# EAGLE design trackuino sensor mk2 chip (EAGLE 7.1.0)
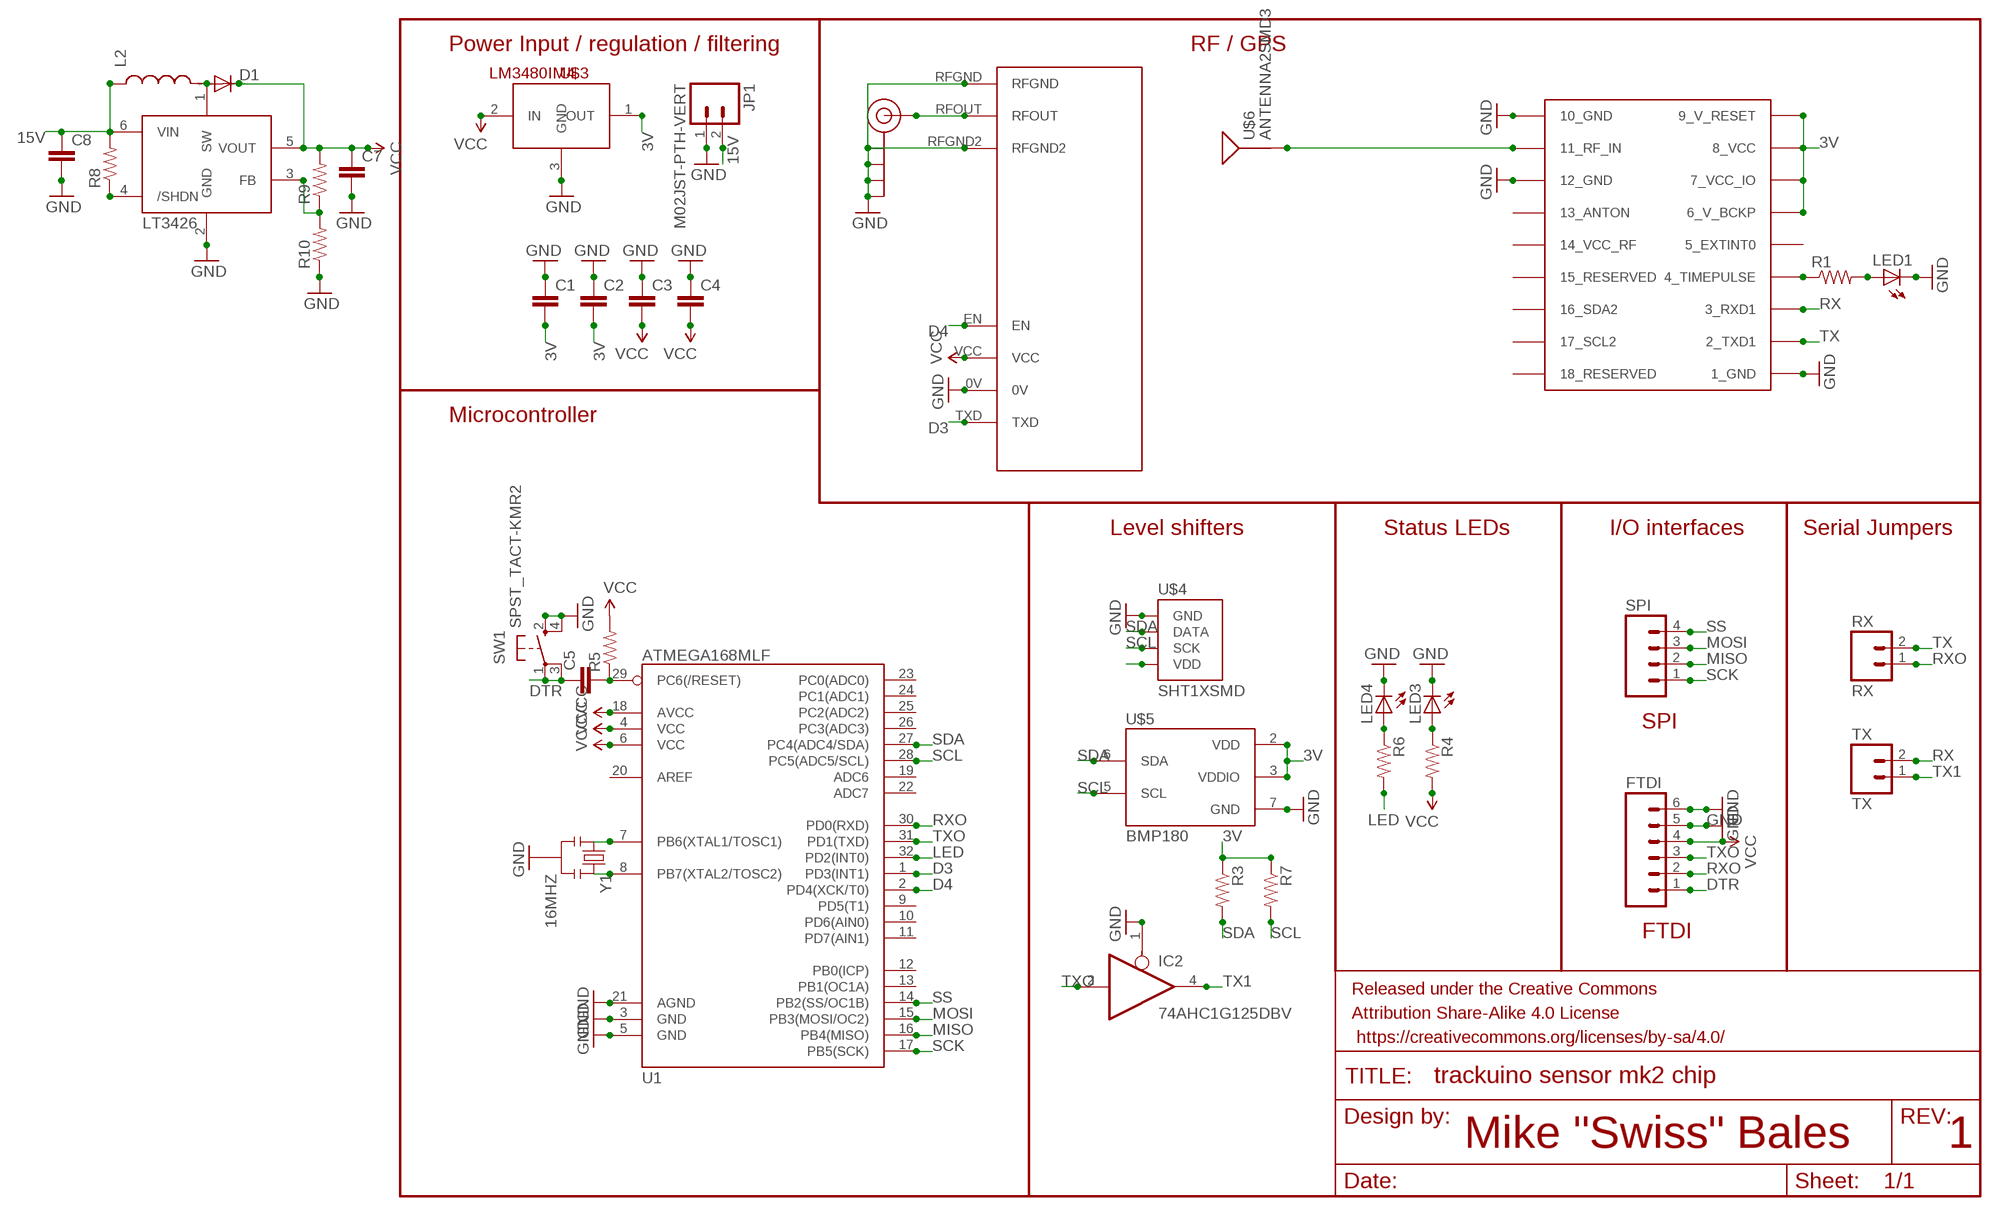
[diagram p0: schematic, sheet 1]

## Parts
C1  CAP0805  [0805]
C2  CAP0805  [0805]
C3  CAP0805  [0805]
C4  CAP0805  [0805]
C5  CAP0805  [0805]
C7  CAP0805  [0805]
C8  CAP0805  [0805]
D1  DIODE-SOD123  [SOD123]
FRAME1  FRAME-LETTER  [CREATIVE_COMMONS]
FTDI  M06NO_SILK_FEMALE_PTH  [1X06_NO_SILK]
IC2  74AHC1G125DBV  [SOT23-5]
J$1  SMA_EDGE  [SMA-EDGE]
JP1  M02JST-PTH-VERT  [JST-2-PTH-VERT]
L2  INDUCTOR0805  [0805]
LED1  LEDCHIP-LED0805  [CHIP-LED0805]
LED3  LEDCHIP-LED0805  [CHIP-LED0805]
LED4  LEDCHIP-LED0805  [CHIP-LED0805]
R1  RESISTOR0805-RES  [0805]
R3  RESISTOR0805-RES  [0805]
R4  RESISTOR0805-RES  [0805]
R5  RESISTOR0805-RES  [0805]
R6  RESISTOR0805-RES  [0805]
R7  RESISTOR0805-RES  [0805]
R8  RESISTOR0805-RES  [0805]
R9  RESISTOR0805-RES  [0805]
R10  RESISTOR0805-RES  [0805]
RX  RX  M02PTH  [1X02]
SPI  M041X04_NO_SILK  [1X04_NO_SILK]
SW1  SPST_TACT-KMR2  [KMR2]
TX  TX  M02PTH  [1X02]
U1  ATMEGA168MLF  [MLF32]
U$1  UBLOX_MAX  [UBLOX_MAX]
U$2  RADIOMETRIX-HX1  [RADIOMETRIX-HX1]
U$3  LM3480IM4  [SOT23-3]
U$4  SHT1XSMD  [SHT1X]
U$5  BMP180  [BMP180]
U$6  ANTENNA2SMD3  [ANTENNA-CHIP4]
U$7  LT3426  [SOT23-6]
Y1  16MHZ  RESONATOR16MHZ  [RESONATOR-SMD]

## Nets
3V: C1.2 C2.2 R3.1 R7.1 U$1.6_V_BCKP U$1.7_VCC_IO U$1.8_VCC U$1.9_V_RESET U$3.1(OUT) U$4.4(VDD) U$5.2(VDD) U$5.3(VDDIO)
15V: C8.1 JP1.2 L2.1 R8.2 U$7.6(VIN)
D3: U1.1(PD3(INT1)) U$2.TXD
D4: U1.2(PD4(XCK/T0)) U$2.EN
DTR: C5.1 FTDI.1 SW1.1(P) SW1.3(P1)
GND: C1.1 C2.1 C3.1 C4.1 C7.2 C8.2 FTDI.5 FTDI.6 IC2.1(OE) J$1.GND@0(GND) J$1.GND@1(GND) J$1.GND@2(GND) J$1.GND@3(GND) JP1.1 LED1.C LED3.C LED4.C R10.1 SW1.2(S) SW1.4(S1) U1.3(GND) U1.5(GND) U1.21(AGND) U$1.1_GND U$1.10_GND U$1.12_GND U$2.0V U$2.RFGND U$2.RFGND2 U$3.3(GND) U$4.1(GND) U$5.7(GND) U$7.2(GND) Y1.2
LED: R6.2 U1.32(PD2(INT0))
MISO: SPI.2 U1.16(PB4(MISO))
MOSI: SPI.3 U1.15(PB3(MOSI/OC2))
N$1: J$1.SIG(SIGNAL) U$2.RFOUT
N$2: R1.1 U$1.4_TIMEPULSE
N$3: LED1.A R1.2
N$6: U$1.11_RF_IN U$6.SIG(SIGNAL)
N$7: C5.2 R5.1 U1.29(PC6(/RESET))
N$8: LED3.A R4.1
N$9: D1.A L2.2 U$7.1(SW)
N$12: R8.1 U$7.4(/SHDN)
N$13: R9.1 R10.2 U$7.3(FB)
N$14: U1.8(PB7(XTAL2/TOSC2)) Y1.3
N$26: U1.7(PB6(XTAL1/TOSC1)) Y1.1
N$27: LED4.A R6.1
RX: TX.2 U$1.3_RXD1
RXO: FTDI.2 RX.1 U1.30(PD0(RXD))
SCK: SPI.1 U1.17(PB5(SCK))
SCL: R7.2 U1.28(PC5(ADC5/SCL)) U$4.3(SCK) U$5.5(SCL)
SDA: R3.2 U1.27(PC4(ADC4/SDA)) U$4.2(DATA) U$5.6(SDA)
SS: SPI.4 U1.14(PB2(SS/OC1B))
TX: RX.2 U$1.2_TXD1
TX1: IC2.4(O) TX.1
TXO: FTDI.3 IC2.2(I) U1.31(PD1(TXD))
VCC: C3.2 C4.2 C7.1 D1.C FTDI.4 R4.2 R5.2 R9.2 U1.4(VCC) U1.6(VCC) U1.18(AVCC) U$2.VCC U$3.2(IN) U$7.5(VOUT)
Unconnected: U1.9(PD5(T1)) U1.10(PD6(AIN0)) U1.11(PD7(AIN1)) U1.12(PB0(ICP)) U1.13(PB1(OC1A)) U1.19(ADC6) U1.20(AREF) U1.22(ADC7) U1.23(PC0(ADC0)) U1.24(PC1(ADC1)) U1.25(PC2(ADC2)) U1.26(PC3(ADC3)) U$1.5_EXTINT0 U$1.13_ANTON U$1.14_VCC_RF U$1.15_RESERVED U$1.16_SDA2 U$1.17_SCL2 U$1.18_RESERVED

## Notes on the sheet
- Power Input / regulation / filtering | RF / GPS
- Microcontroller
- Level shifters | Status LEDs | I/O interfaces | Serial Jumpers
- SPI
- FTDI
- Mike "Swiss" Bales | 1

## Power pins joined to a net without a drawn wire
GND: IC2.3(GND)
VCC: IC2.5(VCC)

## Library data of the parts
C1-C5 C7 C8 = SparkFun-Capacitors:CAP: Capacitor Standard 0603 ceramic capacitor, and 0.1" leaded capacitor.
D1 = diode:DIODE-: DIODE
FRAME1 = SparkFun-Aesthetics:FRAME-LETTER: Schematic Frame Standard 8.5x11 US Letter frame
FTDI = SparkFun-Connectors:M06: Header 6 Standard 6-pin 0.1" header. Use with straight break away headers (SKU : PRT-00116), right angle break away headers (PRT-00553), swiss pins (PRT-00743), machine pins (PRT-00117), and female headers (PRT-00115). Molex polarized connector foot print use with SKU : PRT-08094 with associated crimp pins and housings. NOTES ON THE VARIANTS LOCK and LOCK_LONGPADS... This footprint was designed to help hold the alignment of a through-hole component (i.e. 6-pin header) while soldering it into place. You may notice that each hole has been shifted either up or down by 0.005 of an inch from it's more standard position (which is a perfectly straight line). This slight alteration caused the pins (the squares in the middle) to touch the edges of the holes. Because they are alternating, it causes a "brace" to hold the component in place. 0.005 has proven to be the perfect amount of "off-center" position when using our standard breakaway headers. Although looks a little odd when you look at the bare footprint, once you have a header in there, the alteration is very hard to notice. Also,if you push a header all the way into place, it is covered up entirely on the bottom side. This idea of altering the position of holes to aid alignment will be further integrated into the Sparkfun Library for other footprints. It can help hold any component with 3 or more connection pins.; PROD_ID: CONN-08437
IC2 = 74xx-little-us:74*1G125: Single Bus Buffer Gate with 3-State Output
J$1 = SparkFun-Connectors:SMA_EDGE: SMA Antenna Connector End launch SMA connector. The paste layer has been removed so that the connector can be hand soldered onto the board after reflow.
JP1 RX TX = SparkFun-Connectors:M02: Standard 2-pin 0.1" header. Use with - straight break away headers ( PRT-00116) - right angle break away headers (PRT-00553) - swiss pins (PRT-00743) - machine pins (PRT-00117) - female headers (PRT-00115) Molex polarized connector foot print use with: PRT-08233 with associated crimp pins and housings. 2.54_SCREWTERM for use with PRT-10571. 3.5mm Screw Terminal footprints for PRT-08084 5mm Screw Terminal footprints for use with PRT-08432
L2 = SparkFun-Passives:INDUCTOR: Inductors Basic Inductor/Choke - 0603 and 1206. Footprints are not proven and vary greatly between part numbers. SRN6045- 33uH, 20% 1.4A SDR0403-560KL - 56uH, 10%, 500mA RMS/740mA peak
LED1 LED3 LED4 = adafruit:LED: LED OSRAM: - CHIPLED LG R971, LG N971, LY N971, LG Q971, LY Q971, LO R971, LY R971 LH N974, LH R974 LS Q976, LO Q976, LY Q976 LO Q996 - Hyper CHIPLED LW Q18S LB Q993, LB Q99A, LB R99A - SideLED LS A670, LO A670, LY A670, LG A670, LP A670 LB A673, LV A673, LT A673, LW A673 LH A674 LY A675 LS A676, LA A676, LO A676, LY A676, LW A676 LS A679, LY A679, LG A679 - Hyper Micro SIDELED® LS Y876, LA Y876, LO Y876, LY Y876 LT Y87S - SmartLED LW L88C, LW L88S LB L89C, LB L89S, LG L890 LS L89K, LO L89K, LY L89K LS L896, LA L896, LO L896, LY L896 - TOPLED LS T670, LO T670, LY T670, LG T670, LP T670 LSG T670, LSP T670, LSY T670, LOP T670, LYG T670 LG T671, LOG T671, LSG T671 LB T673, LV T673, LT T673, LW T673 LH T674 LS T676, LA T676, LO T676, LY T676, LB T676, LH T676, LSB T676, LW T676 LB T67C, LV T67C, LT T67C, LS T67K, LO T67K, LY T67K, LW E67C LS E67B, LA E67B, LO E67B, LY E67B, LB E67C, LV E67C, LT E67C LW T67C LS T679, LY T679, LG T679 LS T770, LO T770, LY T770, LG T770, LP T770 LB T773, LV T773, LT T773, LW T773 LH T774 LS E675, LA E675, LY E675, LS T675 LS T776, LA T776, LO T776, LY T776, LB T776 LHGB T686 LT T68C, LB T68C - Hyper Mini TOPLED® LB M676 - Mini TOPLED Santana® LG M470 LS M47K, LO M47K, LY M47K Source: http://www.osram.convergy.de/
R1 R3-R10 = SparkFun-Resistors:RESISTOR: Resistor Basic schematic elements and footprints for 0603, 1206, and PTH resistors.
SPI = SparkFun-Connectors:M04: Header 4 Standard 4-pin 0.1" header. Use with straight break away headers (SKU : PRT-00116), right angle break away headers (PRT-00553), swiss pins (PRT-00743), machine pins (PRT-00117), and female headers (PRT-00115). Molex polarized connector foot print use with SKU : PRT-08231 with associated crimp pins and housings. 1MM SMD Version SKU: PRT-10208
SW1 = adafruit:SPST_TACT: SMT 6mm switch, EVQQ2 series http://www.ladyada.net/library/eagle
U1 = SparkFun-DigitalIC:ATMEGA168: Atmel 32-pin 8-bit micro, 16k flash.
U$1 = Ava:UBLOX_MAX: UBLOX MAX
U$2 = Ava:RADIOMETRIX-HX1
U$3 = SparkFun-PowerIC:LM3480IM4: Small package linear regulator
U$4 = SparkFun-Sensors:SHT1X: SHT1x Humdity Sensor Sensirion humdity sensor. Schematic element and footprint proven. Spark Fun Electronics SKU : COM-08227
U$5 = SparkFun-Sensors:BMP180: BOSCH BMP180 DIGITAL BAROMETRIC PRESSURE SENSOR Web page: http://www.bosch-sensortec.com/en/homepage/products_3/environmental_sensors_1/bmp180_1/bmp180 Datasheet: http://ae-bst.resource.bosch.com/media/products/dokumente/bmp180/BST-BMP180-DS000-09.pdf The BMP180 is the function compatible successor of the BMP085, a new generation of high precision digital pressure sensors for consumer applications. The ultra-low power, low voltage electronics of the BMP180 is optimized for use in mobile phones, PDAs, GPS navigation devices and outdoor equipment. With a low altitude noise of merely 0.25m at fast conversion time, the BMP180 offers superior performance. The I2C interface allows for easy system integration with a microcontroller. The BMP180 is based on piezo-resistive technology for EMC robustness, high accuracy and linearity as well as long term stability. Key features: - Temperature measurement included - I2C interface - Fully calibrated - Pb-free, halogen-free and RoHS compliant, - MSL 1 Basic specs: Pressure range: 300 to 1100hPa (+9000m to -500m relating to sea level) Supply voltage: 1.8 to 3.6V (VDD), 1.62V to 3.6V (VDDIO) Package: LGA package with metal lid Small footprint: 3.6mm x 3.8mm Super-flat: 0.93mm height Low power: 5μA at 1 sample / sec. in standard mode Low noise: 0.06hPa (0.5m) in ultra low power mode, 0.02hPa (0.17m) advanced resolution mode Typical applications: - Enhancement of GPS navigation (dead-reckoning, slope detection, etc.) - In- and out-door navigation - Leisure and sports - Weather forecast - Vertical velocity indication (rise/sink speed)
U$6 = SparkFun-RF:ANTENNA2: Chip antenna Single endded antenna. Common with smaller chip antennas. CHIP4 package is the GPS Chip Antenna SKU: GPS-08418. CHIP5 package is 2.4GHz chip antenna SKU: WRL-00144.
U$7 = adafruit:LT3426: LT3426 1.2MHz, 2A boost converter in SOT-23 http://www.linear.com/pc/productDetail.jsp?navId=H0,C1,C1003,C1042,C1031,C1061,P8430 (Linear website)
Y1 = SparkFun-FreqCtrl:RESONATOR: Resonator Small SMD resonator. Used, eg, on the Arduino Pro/ Pro Mini boards. 8MHz- XTAL-08895 16MHz- XTAL-08900; PROD_ID: XTAL-08900

## Board
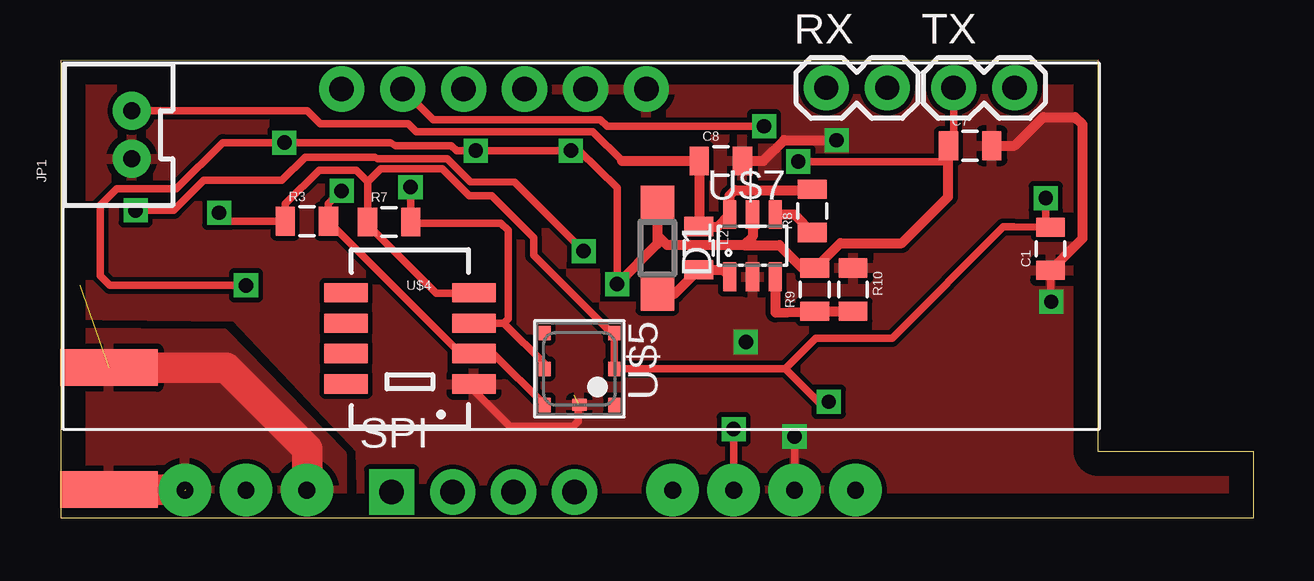
[diagram p1: board, top side]
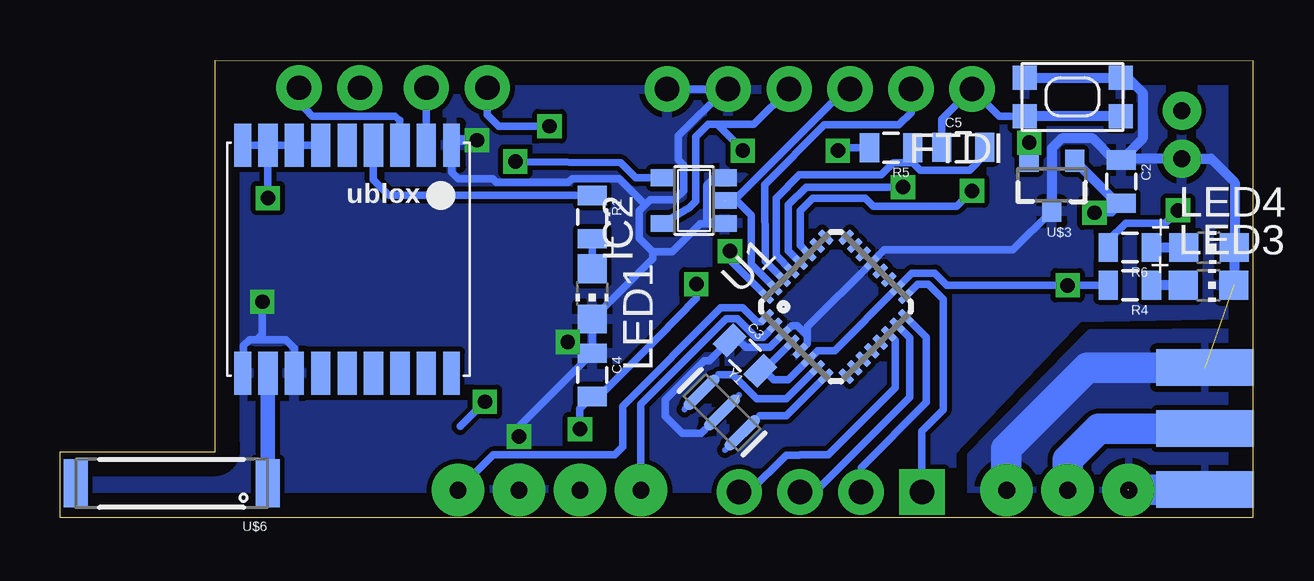
[diagram p2: board, bottom side, seen from below]

Size 49.71 x 19.07 mm. Coordinates in mm from the lower left corner, seen from the top.
Outline: 0,0 49.71,0 49.71,2.74 43.23,2.74 43.23,3 43.23,19.07 0,19.04 0,0
Copper layers (1*16): Top 0.035mm / dielectric 1.5mm / Bottom 0.035mm
Design rules "default": minimum track width 10mil, minimum drill 24mil, track to track 8mil, track to pad 8mil, pad to pad 8mil, via to via 8mil, smd to smd 8mil, copper to edge 40mil, drill to drill 8mil, minimum pad ring 10mil, minimum via ring 8mil, stop-mask expansion 4mil, vias tented up to drill 0mil, thermal gap 10mil

### Footprints (pad centres in the part's own frame; a part is rotated, then mirrored left to right if it is on the bottom)
0805 = smd 0.8 x 1.2: 1 -0.9,0; 2 0.9,0
SOD123 = smd 1.4 x 1.4: A 1.9,0; C -1.9,0
1X06_NO_SILK = drill 1.016 pad 1.88: 1 0,0; 2 2.54,0; 3 5.08,0; 4 7.62,0; 5 10.16,0; 6 12.7,0
SOT23-5 = smd 0.69 x 0.99: 1 -0.95,-1.29; 2 0,-1.29; 3 0.95,-1.29; 4 0.95,1.3; 5 -0.95,1.3
SMA-EDGE = smd 1.524 x 4.064: GND@0 0,0; GND@1 5.08,0; SIG 2.54,0 | smd 1.524 x 4.064 bottom: GND@2 0,0; GND@3 5.08,0
JST-2-PTH-VERT = drill 0.7 pad 1.6: 1 -1,-0.55; 2 1,-0.55
CHIP-LED0805 = smd 1.2 x 1.2: A 0,-1.05; C 0,1.05
1X02 = drill 1.016 pad 1.88: 1 0,0; 2 2.54,0
1X04_NO_SILK = drill 1.016 pad 1.88 square: 1 0,0 | drill 1.016 pad 1.88: 2 2.54,0; 3 5.08,0; 4 7.62,0
KMR2 = smd 1 x 1: 1 2,0.8; 2 2,-0.8; 3 -2,0.8; 4 -2,-0.8
MLF32 = smd 0.7 x 0.3: 1 -2.35,1.75; 2 -2.35,1.25; 3 -2.35,0.75; 4 -2.35,0.25; 5 -2.35,-0.25; 6 -2.35,-0.75; 7 -2.35,-1.25; 8 -2.35,-1.75; 17 2.35,-1.75; 18 2.35,-1.25; 19 2.35,-0.75; 20 2.35,-0.25; 21 2.35,0.25; 22 2.35,0.75; 23 2.35,1.25; 24 2.35,1.75 | smd 0.3 x 0.7: 9 -1.75,-2.35; 10 -1.25,-2.35; 11 -0.75,-2.35; 12 -0.25,-2.35; 13 0.25,-2.35; 14 0.75,-2.35; 15 1.25,-2.35; 16 1.75,-2.35; 25 1.75,2.35; 26 1.25,2.35; 27 0.75,2.35; 28 0.25,2.35; 29 -0.25,2.35; 30 -0.75,2.35; 31 -1.25,2.35; 32 -1.75,2.35
UBLOX_MAX = smd 1.8 x 0.7: 1_GND 4.95,-4.4; 9_V_RESET 4.95,4.3; 10_GND -4.55,4.3; 18_RESERVED -4.55,-4.4 | smd 1.8 x 0.8: 2_TXD1 4.95,-3.35; 3_RXD1 4.95,-2.25; 4_TIMEPULSE 4.95,-1.15; 5_EXTINT0 4.95,-0.05; 6_V_BCKP 4.95,1.05; 7_VCC_IO 4.95,2.15; 8_VCC 4.95,3.25; 11_RF_IN -4.55,3.25; 12_GND -4.55,2.15; 13_ANTON -4.55,1.05; 14_VCC_RF -4.55,-0.05; 15_RESERVED -4.55,-1.15; 16_SDA2 -4.55,-2.25; 17_SCL2 -4.55,-3.35
RADIOMETRIX-HX1 = drill 0.7 pad 2.184: 0V 8.89,-10.16; EN 3.81,-10.16; RFGND -11.43,-10.16; RFGND2 -16.51,-10.16; RFOUT -13.97,-10.16; TXD 11.43,-10.16; VCC 6.35,-10.16
SOT23-3 = smd 0.8 x 0.9: 1 -0.95,-1; 2 0.95,-1; 3 0,1.1
SHT1X = smd 1.8 x 0.8: 1 -2.667,1.905; 2 -2.667,0.635; 3 -2.667,-0.635; 4 -2.667,-1.905; 5 2.667,-1.905; 6 2.667,-0.635; 7 2.667,0.635; 8 2.667,1.905
BMP180 = smd 0.6 x 0.5: 1 1.5,1.45; 2 0,1.45; 3 -1.5,1.45; 4 -1.5,-1.45; 5 0,-1.45; 6 1.5,-1.45 | smd 0.5 x 0.6: 7 1.5,0
ANTENNA-CHIP4 = smd 1 x 2: NC 4,0; SIG -4,0
SOT23-6 = smd 0.55 x 1.2: 1 -0.95,-1.3; 2 0,-1.3; 3 0.95,-1.3; 4 0.95,1.3; 5 0,1.3; 6 -0.95,1.3
RESONATOR-SMD = smd 0.45 x 1.905: 1 -1.2,0; 2 0,0; 3 1.2,0

### Placement (x,y rotation side)
C1  41.25,11.2 90 top
C2  5.49,14 270 bottom
C3  21.16,6.76 315 bottom
C4  27.53,5.94 270 bottom
C5  12.07,15.43 0 bottom
C7  37.9,15.49 0 top
C8  27.51,14.86 0 top
D1  24.87,11.23 270 top
FRAME1  14.38,-8.15 0 top  (outside the outline)
FTDI  11.71,17.86 180 bottom
IC2  23.29,13.21 90 bottom
J$1  2.01,1.17 90 bottom
JP1  2.41,15.95 90 top
L2  26.59,11.23 270 top
LED1  27.53,9.32 180 bottom
LED3  1.85,9.68 270 bottom
LED4  1.83,11.25 270 bottom
R1  27.53,12.52 270 bottom
R3  10.26,12.34 0 top
R4  5.13,9.68 180 bottom
R5  15.08,15.41 180 bottom
R6  5.13,11.25 180 bottom
R7  13.69,12.32 0 top
R8  31.32,12.78 90 top
R9  31.42,9.5 90 top
R10  33.02,9.5 270 top
RX  31.9,17.91 0 top
SPI  13.79,1.07 0 top
SW1  7.52,17.53 180 bottom
TX  37.21,17.91 0 top
U1  17.37,8.79 45 bottom
U$1  37.8,10.57 90 bottom
U$2  21.69,11.3 0 top
U$3  8.38,13.87 180 bottom
U$4  14.55,7.47 180 top
U$5  21.62,6.2 270 top
U$6  45.06,1.42 180 bottom
U$7  28.83,11.33 0 top
Y1  22.13,4.38 315 bottom

### Tracks (layer width: path | path; a pad name or v marks a point on that pad's centre or on a via)
3V  (via drill 0.6)
  Top 0.305: v6.6,12.7 6.96,12.34 R3.1 9.36,13.07 10.77,14.48 12.32,14.48 12.8,14 | 12.8,14 12.8,12.33 R7.1 12.79,12.2 15.65,9.35 17.2,9.35 U$4.4 | 12.8,14 13.33,14.53 15.9,14.53 17.02,13.41 17.96,13.41 19.71,11.66 19.71,10.92 22.93,7.7 U$5.3 U$5.2 30.2,6.2 | 30.2,6.2 31.47,7.47 34.65,7.47 39.27,12.12 39.71,12.12 40.71,12.11 | 40.71,12.11 C1.2 | v41.05,13.31 41.05,12.44 40.71,12.11 | v32,4.83 31.57,4.83 30.2,6.2
  Bottom 0.305: U$1.6_V_BCKP U$1.7_VCC_IO U$1.8_VCC | U$1.8_VCC U$1.9_V_RESET | v6.6,12.7 5.88,12.7 C2.2 | U$1.8_VCC 41.04,14.05 v41.05,13.31 | 33.03,3.8 v32,4.83
  Bottom 0.406: C2.2 5.66,13.1 U$3.1
15V
  Top 0.305: JP1.2 10.28,16.95 10.82,16.41 14.48,16.41 14.81,16.08 22.17,16.08 23.39,14.86
  Top 0.406: 23.39,14.86 C8.1 26.61,12.14 L2.1 27.38,12.13 U$7.6 27.88,13.43 28.09,13.64 31.43,13.64 R8.2
D3
  Bottom 0.305: U1.1 20.48,8.15 20.68,8.15 21.26,8.74 22.17,8.74 26.26,4.65 26.26,2.95 26.59,2.62 31.65,2.62 U$2.TXD
D4
  Bottom 0.305: U1.2 20.41,7.52 20.73,7.52 21.49,8.28 21.95,8.28 25.5,4.72 U$2.EN
DTR
  Bottom 0.305: SW1.1 10.58,16.73 FTDI.1 12.97,16.59 C5.1
  Bottom 0.406: SW1.3 SW1.1
GND  (via drill 0.6)  (3 unrouted)
  Top 0.305: U$4.1 17.22,5.31 18.72,3.81 21.36,3.81 21.56,4.01 21.56,4.65 U$5.7 | C1.1 41.25,9.02 v41.27,8.99 | U$2.0V v30.58,3.38
  Top 0.406: C8.2 29.29,14.86 30.15,15.72 v32.33,15.72 | C7.2 39.75,15.49 40.94,16.69 42.27,16.69 42.57,16.38 42.57,11.62 C1.1
  Top 1.27: J$1.GND@1 6.91,6.25 10.29,2.87 10.29,1.17 U$2.RFGND | 1.9,1.17 5.21,1.17
  Bottom 0.305: U1.5 18.57,7.24 18.57,7.57 | 18.57,7.57 19,8 19.22,8 U1.3 20.14,7.09 21.13,7.09 21.44,7.39 C3.1 22.66,6.53 22.86,6.53 24.49,4.9 24.49,4.22 23.77,3.51 23,3.51 22.84,3.66 | 18.57,7.57 18.57,7.95 U1.21 15.37,11.15 10,11.15 U$3.3 | U$1.12_GND 39.94,7.05 40.31,7.42 41.5,7.42 | 41.5,7.42 41.81,7.42 42.06,7.16 42.06,6.05 U$1.10_GND | FTDI.6 FTDI.5 22,17.86 23.95,15.9 23.95,14.91 23.72,14.68 23.72,13.61 24.1,13.23 25.12,13.23 25.32,13.03 | 25.32,13.03 25.58,12.78 25.58,11.63 25.02,11.07 | 25.02,11.07 24.21,11.07 23.04,12.24 22.55,12.24 | 22.55,12.24 22.02,12.24 IC2.1 | IC2.3 22.44,14.16 22.76,13.84 22.76,12.45 22.55,12.24 | 25.02,11.07 25.02,10.79 LED1.C C4.1 30.58,3.8 v30.58,3.38 | U$1.1_GND 33.39,14.4 33.12,14.12 31.67,14.12 31.52,13.97 28.52,13.97 28.37,14.12 26.42,14.12 25.32,13.03 | v41.27,8.99 41.27,7.65 41.5,7.42
  Bottom 0.406: SW1.2 SW1.4 5.22,18.33 4.6,17.7 4.6,15.78 C2.1 | LED3.C 0.78,9.7 LED4.C 0.76,11.27 0.76,13.97 1.74,14.95 JP1.1 5.43,14.95 C2.1 | C2.1 5.78,14.9 6.68,15.8 7.98,15.8 8.38,15.39 U$3.3 | v32.33,15.72 33.19,15.72 U$1.1_GND
  Bottom 1.27: U$2.RFGND2 5.16,1.17 J$1.GND@2 | J$1.GND@1 6.91,6.25 10.29,2.87 10.29,1.17 U$2.RFGND
  other vias: 28.55,7.32
  pour Top: -0.13,19.05 43.33,18.97 43.41,2.84 43.41,3.05 49.96,3.05 49.96,-0.63 49.94,-0.63 12.6,-0.48 12.5,2.82 7.29,8.36 -0.1,8.43
  pour Bottom: -0.15,19.05 43.33,19 43.43,3.02 43.43,2.97 49.96,2.97 49.96,-0.53 43.31,-0.53 12.7,-0.48 12.55,-0.33 12.55,2.79 7.29,8.36 -0.2,8.48
  pour Top: -0.1,7.72 6.81,7.67 11.71,2.64 11.71,-0.48 -0.1,-0.36
  pour Bottom: -0.1,7.75 6.78,7.7 11.76,2.59 11.76,-0.46 0,-0.43
LED  (via drill 0.6)
  Top 0.305: v3.12,12.8 4.72,12.8 5.97,14.05 9.22,14.05 10.19,15.01 13.08,15.01 13.21,14.96 16.1,14.96 17.07,14 18.92,13.97 v21.79,11.1
  Bottom 0.305: R6.2 6.03,11.55 5.31,12.27 3.66,12.27 v3.12,12.8 | v21.79,11.1 21.79,10.73 U1.32
MISO
  Bottom 0.305: U1.16 13.61,7.5 13.61,4.8 16.33,2.08 SPI.2
MOSI
  Bottom 0.305: U1.15 14.3,7.48 14.3,5 18.24,1.07 SPI.3
N$1
  Bottom 1.27: J$1.SIG 6.43,3.71 7.72,2.41 U$2.RFOUT
N$2
  Bottom 0.305: R1.1 36,13.42 36.65,14.07 U$1.4_TIMEPULSE
N$3
  Bottom 0.305: R1.2 LED1.A
N$6
  Bottom 0.61: U$1.11_RF_IN 41.06,6.02 U$6.SIG
N$7
  Bottom 0.305: C5.2 11.17,15.12 11.81,14.48 13.87,14.48 14.17,14.78 | 14.17,14.78 R5.1 | 14.17,14.78 14.99,14.78 15.49,14.27 18.9,14.27 19.86,13.31 19.86,10.92 U1.29
N$8
  Bottom 0.406: LED3.A R4.1
N$9
  Top 0.406: D1.A 25.59,9.33 L2.2 27.58,10.33 U$7.1
N$12
  Top 0.406: U$7.4 30.57,12.63 R8.1
N$13
  Top 0.406: U$7.3 29.78,8.54 R9.1 R10.2
N$14
  Bottom 0.305: U1.8 19.44,4.25 20.56,4.25
N$26
  Bottom 0.305: U1.7 19.44,4.95 20.68,4.95 21.67,5.95 22.26,5.95
N$27
  Bottom 0.406: LED4.A R6.1
RX
  Bottom 0.305: U$1.3_RXD1 35.54,16.55 35.76,16.71 39.19,16.71 39.75,17.32 TX.2
RXO  (via drill 0.6)
  Top 0.305: v29.31,16.31 22.78,16.31 22.48,16.59 15.52,16.59 FTDI.2
  Bottom 0.305: U1.30 20.32,10.67 20.35,13.87 17.86,16.36 14.76,16.36 14.25,16.87 FTDI.2 | RX.1 31.9,16.79 31.42,16.31 v29.31,16.31
SCK
  Bottom 0.305: U1.17 13.96,9.73 13.54,9.73 12.9,9.09 12.9,4.5 13.79,3.61 SPI.1
SCL  (via drill 0.6)
  Top 0.305: v14.58,13.77 14.59,13.27 R7.2 14.64,12.27 18.34,12.27 18.64,11.96 18.64,8.28 18.47,8.1 | U$4.3 18.47,8.1 | U$5.5 20.17,6.4 18.47,8.1
  Bottom 0.305: U1.28 19.35,11.12 19.35,13.03 18.62,13.77 v14.58,13.77
SDA  (via drill 0.6)
  Top 0.305: v11.71,13.61 11.68,13.61 11.15,13.08 11.15,12.36 R3.2 16.67,6.83 U$4.2 18.03,6.83 U$5.6
  Bottom 0.305: U1.27 18.87,11.35 18.87,12.78 18.34,13.31 16.15,13.31 15.82,12.98 12.34,12.98 v11.71,13.61
SS
  Bottom 0.305: U1.14 14.91,7.39 14.91,5.41 17.7,2.62 18.87,2.62 18.9,2.59 19.46,2.59 20.98,1.07 SPI.4
TX
  Bottom 0.305: RX.2 U$1.2_TXD1
TX1  (via drill 0.6)
  Top 0.305: v30.73,14.83 36.83,14.83 37.21,15.21 TX.1
  Bottom 0.305: IC2.4 25.71,14.16 26.34,14.78 30.72,14.82 v30.73,14.83
TXO
  Bottom 0.305: FTDI.3 16.99,17.86 21.51,13.34 | 21.51,13.34 21.87,13.34 IC2.2 | U1.31 20.9,10.55 20.9,12.6 21.51,13.21 21.51,13.34
VCC  (via drill 0.6)
  Top 0.305: v7.72,9.68 2.06,9.68 1.65,10.08 1.65,13 2.34,13.69 4.83,13.69 6.76,15.62 v9.32,15.62 13.74,15.62 13.97,15.49 16.28,15.49 16.51,15.29 v17.3,15.29 v21.26,15.29 21.62,15.29 23.19,13.74 v23.19,9.73 | U$2.VCC v28.04,3.68
  Top 0.406: D1.C 24.87,11.76 | 24.87,11.76 24.87,11.4 v23.19,9.73 | U$7.5 28.83,11.71 28.47,11.35 | 28.47,11.35 25.27,11.35 24.87,11.76 | 28.47,11.35 29.95,11.35 30.91,10.39 31.41,10.39 R9.2 31.46,10.4 32.49,11.43 35.05,11.43 36.98,13.36 36.98,15.48 C7.1
  Bottom 0.305: U1.4 20.34,6.17 C3.2 20.37,6.15 19.96,5.74 19.36,5.74 U1.6 18.14,6.96 17.43,6.96 U1.18 14.21,10.19 13.26,10.19 12.75,9.68 v7.72,9.68 R4.2 | IC2.5 23.48,12.92 23.22,13.18 23.22,15.88 22.71,16.38 22.33,16.38 | 22.33,16.38 20.8,16.38 FTDI.4 | v9.32,15.62 9.32,14.88 U$3.2 | R5.2 17.05,15.41 v17.3,15.29 | v21.26,15.29 21.49,15.54 22.33,16.38 | v28.04,3.68 28.04,4.54 C4.2 27.26,5.04 24.79,7.52 23.19,9.14 v23.19,9.73